# EAGLE design M705ok (EAGLE 6.6.0)
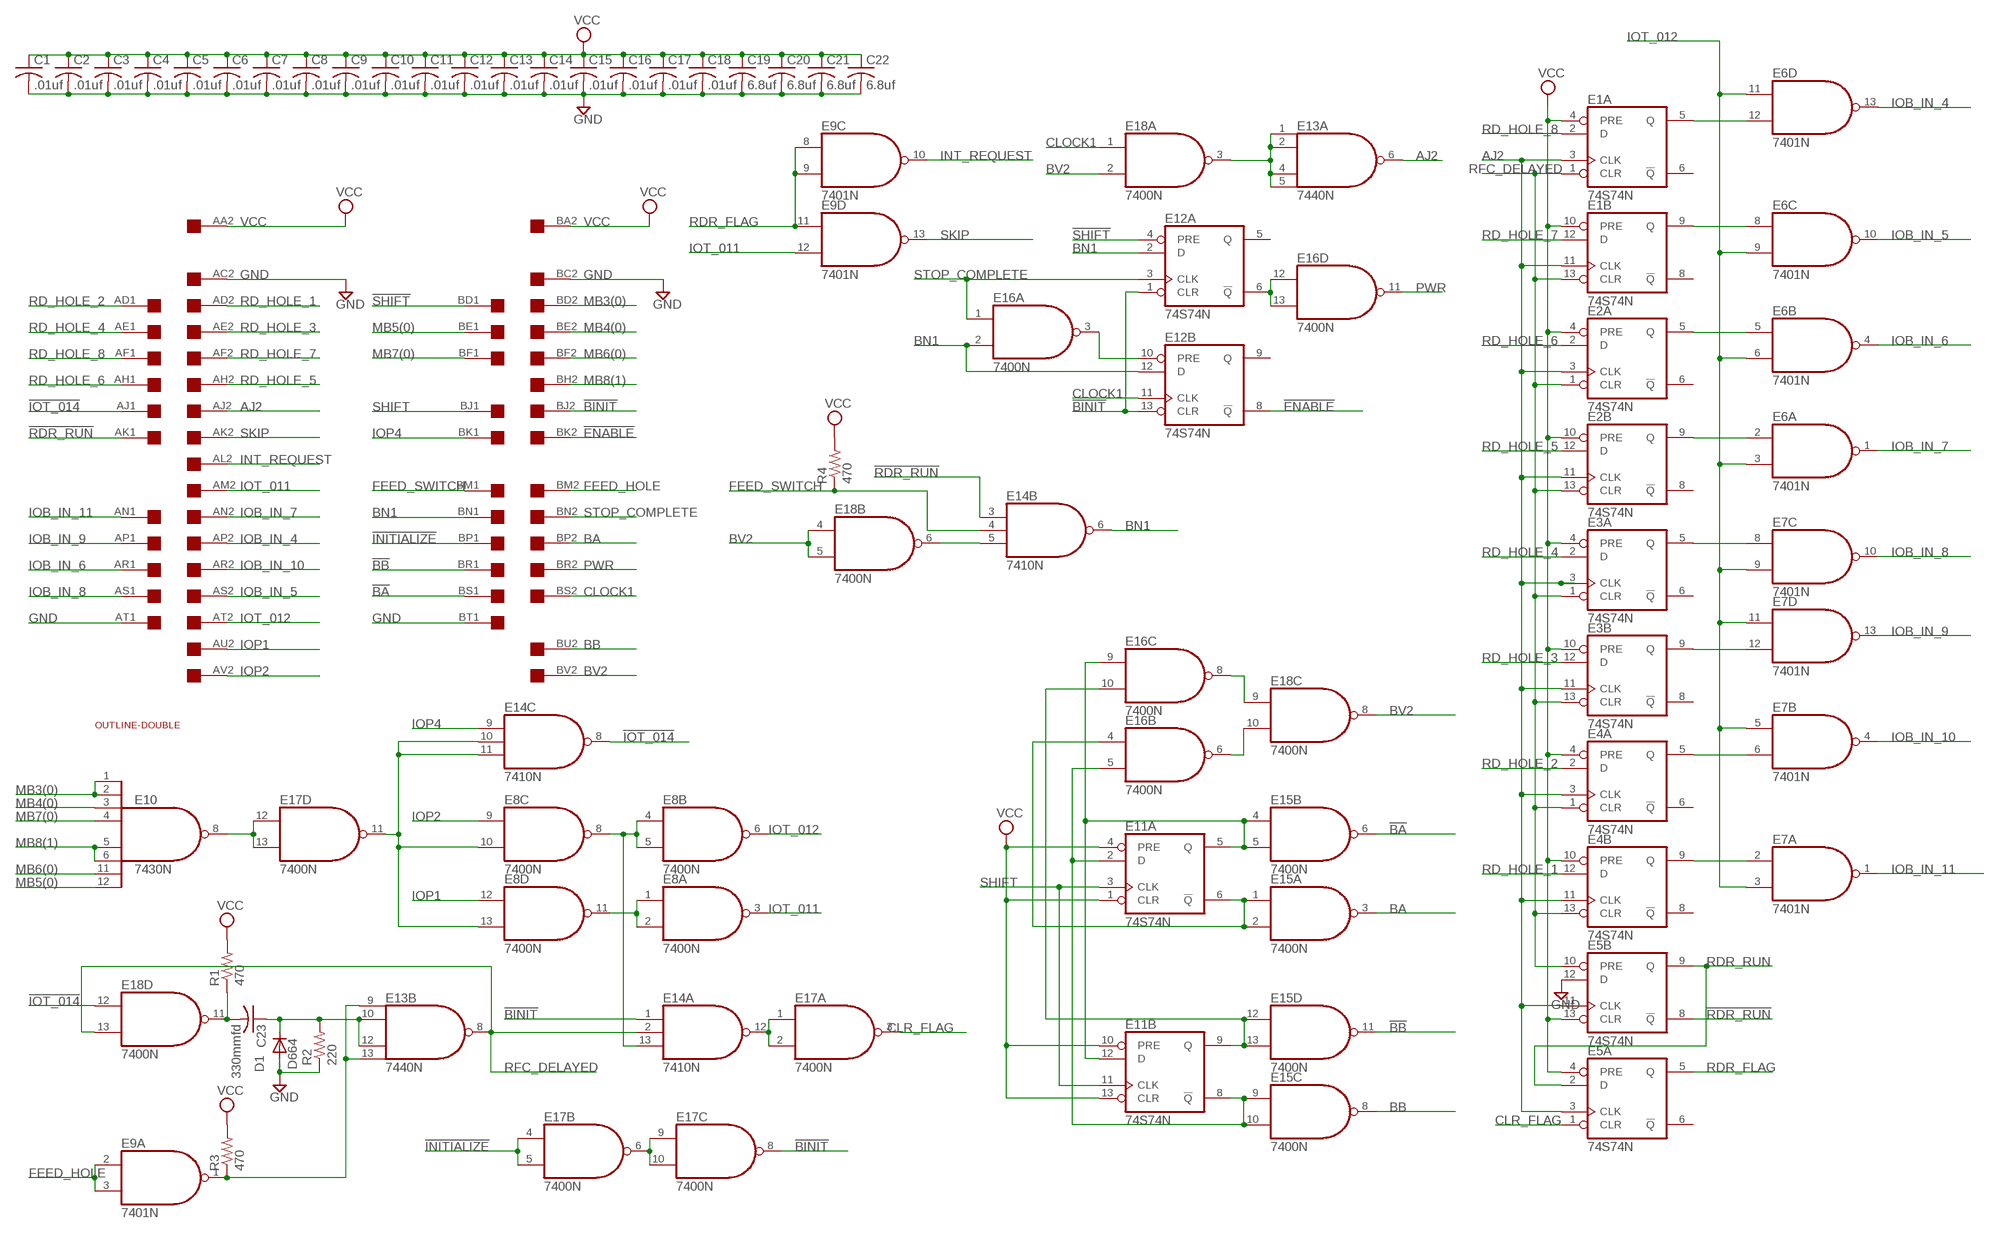
[diagram p0: schematic, sheet 1]

## Parts
C1  .01uf  C-US050-025X075  [C050-025X075]
C2  .01uf  C-US050-025X075  [C050-025X075]
C3  .01uf  C-US050-025X075  [C050-025X075]
C4  .01uf  C-US050-025X075  [C050-025X075]
C5  .01uf  C-US050-025X075  [C050-025X075]
C6  .01uf  C-US050-025X075  [C050-025X075]
C7  .01uf  C-US050-025X075  [C050-025X075]
C8  .01uf  C-US050-025X075  [C050-025X075]
C9  .01uf  C-US050-025X075  [C050-025X075]
C10  .01uf  C-US050-025X075  [C050-025X075]
C11  .01uf  C-US050-025X075  [C050-025X075]
C12  .01uf  C-US050-025X075  [C050-025X075]
C13  .01uf  C-US050-025X075  [C050-025X075]
C14  .01uf  C-US050-025X075  [C050-025X075]
C15  .01uf  C-US050-025X075  [C050-025X075]
C16  .01uf  C-US050-025X075  [C050-025X075]
C17  .01uf  C-US050-025X075  [C050-025X075]
C18  .01uf  C-US050-025X075  [C050-025X075]
C19  6.8uf  C-US150-054X183  [C150-054X183]
C20  6.8uf  C-US150-054X183  [C150-054X183]
C21  6.8uf  C-US150-054X183  [C150-054X183]
C22  6.8uf  C-US150-054X183  [C150-054X183]
C23  330mmfd  C-US050-025X075  [C050-025X075]
D1  D664  1N4148DO35-10  [DO35-10]
E1  74S74N  [DIL14]
E2  74S74N  [DIL14]
E3  74S74N  [DIL14]
E4  74S74N  [DIL14]
E5  74S74N  [DIL14]
E6  7401N  74LS01N  [DIL14]
E7  7401N  74LS01N  [DIL14]
E8  7400N  [DIL14]
E9  7401N  74LS01N  [DIL14]
E10  7430N  [DIL14]
E11  74S74N  [DIL14]
E12  74S74N  [DIL14]
E13  7440N  74S20N  [DIL14]
E14  7410N  [DIL14]
E15  7400N  [DIL14]
E16  7400N  [DIL14]
E17  7400N  [DIL14]
E18  7400N  [DIL14]
R1  470  R-US_0207/10  [0207/10]
R2  220  R-US_0207/10  [0207/10]
R3  470  R-US_0207/10  [0207/10]
R4  470  R-US_0207/10  [0207/10]
U$5  DOUBLE  [EDGE-CON4]
U$6  OUTLINE-DOUBLE  [DOUBLE]

## Nets
!BA: E15.6(B:O) U$5.BS1
!BB: E15.11(D:O) U$5.BR1
!BINIT: E12.1(A:CLR) E12.13(B:CLR) E14.1(A:I0) E17.8(C:O) U$5.BJ2
!ENABLE: E12.8(B:!Q) U$5.BK2
!INITIALIZE: E17.4(B:I0) E17.5(B:I1) U$5.BP1
!IOT_014: E14.8(C:O) E18.12(D:I0) U$5.AJ1
!RDR_RUN: E5.8(B:!Q) E14.3(B:I0) U$5.AK1
!SHIFT: E12.4(A:PRE) U$5.BD1
AJ2: E1.3(A:CLK) E1.11(B:CLK) E2.3(A:CLK) E2.11(B:CLK) E3.3(A:CLK) E3.11(B:CLK) E4.3(A:CLK) E4.11(B:CLK) E5.3(A:CLK) E5.11(B:CLK) E13.6(A:O) U$5.AJ2
BA: E15.3(A:O) U$5.BP2
BB: E15.8(C:O) U$5.BU2
BN1: E12.2(A:D) E12.12(B:D) E14.6(B:O) E16.2(A:I1) U$5.BN1
BV2: E18.2(A:I1) E18.4(B:I0) E18.5(B:I1) E18.8(C:O) U$5.BV2
CLOCK1: E12.11(B:CLK) E18.1(A:I0) U$5.BS2
CLR_FLAG: E5.1(A:CLR) E17.3(A:O)
FEED_HOLE: E9.2(A:I0) E9.3(A:I1) U$5.BM2
FEED_SWITCH: E14.4(B:I1) R4.1 U$5.BM1
GND: C1.2 C2.2 C3.2 C4.2 C5.2 C6.2 C7.2 C8.2 C9.2 C10.2 C11.2 C12.2 C13.2 C14.2 C15.2 C16.2 C17.2 C18.2 C19.2 C20.2 C21.2 C22.2 D1.A E5.12(B:D) R2.1 U$5.AC2 U$5.AT1 U$5.BC2 U$5.BT1
INT_REQUEST: E9.10(C:O) U$5.AL2
IOB_IN_4: E6.13(D:O) U$5.AP2
IOB_IN_5: E6.10(C:O) U$5.AS2
IOB_IN_6: E6.4(B:O) U$5.AR1
IOB_IN_7: E6.1(A:O) U$5.AN2
IOB_IN_8: E7.10(C:O) U$5.AS1
IOB_IN_9: E7.13(D:O) U$5.AP1
IOB_IN_10: E7.4(B:O) U$5.AR2
IOB_IN_11: E7.1(A:O) U$5.AN1
IOP1: E8.12(D:I0) U$5.AU2
IOP2: E8.9(C:I0) U$5.AV2
IOP4: E14.9(C:I0) U$5.BK1
IOT_011: E8.3(A:O) E9.12(D:I1) U$5.AM2
IOT_012: E6.3(A:I1) E6.6(B:I1) E6.9(C:I1) E6.11(D:I0) E7.3(A:I1) E7.5(B:I0) E7.9(C:I1) E7.11(D:I0) E8.6(B:O) U$5.AT2
MB3(0): E10.1(I0) E10.2(I1) U$5.BD2
MB4(0): E10.3(I2) U$5.BE2
MB5(0): E10.12(I7) U$5.BE1
MB6(0): E10.11(I6) U$5.BF2
MB7(0): E10.4(I3) U$5.BF1
MB8(1): E10.5(I4) E10.6(I5) U$5.BH2
N$2: E1.5(A:Q) E6.12(D:I1)
N$3: E1.9(B:Q) E6.8(C:I0)
N$4: E11.6(A:!Q) E15.1(A:I0) E15.2(A:I1) E16.4(B:I0)
N$5: E10.8(O) E17.12(D:I0) E17.13(D:I1)
N$6: E8.4(B:I0) E8.5(B:I1) E8.8(C:O) E14.13(A:I2)
N$7: E8.1(A:I0) E8.2(A:I1) E8.11(D:O)
N$8: E8.10(C:I1) E8.13(D:I1) E14.10(C:I1) E14.11(C:I2) E17.11(D:O)
N$9: E2.5(A:Q) E6.5(B:I0)
N$10: E2.9(B:Q) E6.2(A:I0)
N$11: E3.5(A:Q) E7.8(C:I0)
N$12: E3.9(B:Q) E7.12(D:I1)
N$13: E4.5(A:Q) E7.6(B:I1)
N$14: E4.9(B:Q) E7.2(A:I0)
N$16: E11.5(A:Q) E11.12(B:D) E15.4(B:I0) E15.5(B:I1) E16.9(C:I0)
N$17: E11.9(B:Q) E15.12(D:I0) E15.13(D:I1) E16.10(C:I1)
N$18: E11.2(A:D) E11.8(B:!Q) E15.9(C:I0) E15.10(C:I1) E16.5(B:I1)
N$19: E16.8(C:O) E18.9(C:I0)
N$20: E16.6(B:O) E18.10(C:I1)
N$21: E13.1(A:I0) E13.2(A:I1) E13.4(A:I2) E13.5(A:I3) E18.3(A:O)
N$22: E12.6(A:!Q) E16.12(D:I0) E16.13(D:I1)
N$23: E12.10(B:PRE) E16.3(A:O)
N$24: C23.2 E18.11(D:O) R1.1
N$25: C23.1 D1.C E13.10(B:I1) E13.12(B:I2) R2.2
N$26: E9.1(A:O) E13.9(B:I0) E13.13(B:I3) R3.1
N$28: E17.6(B:O) E17.9(C:I0) E17.10(C:I1)
N$29: E14.12(A:O) E17.1(A:I0) E17.2(A:I1)
N$30: E14.5(B:I2) E18.6(B:O)
PWR: E16.11(D:O) U$5.BR2
RD_HOLE_1: E4.12(B:D) U$5.AD2
RD_HOLE_2: E4.2(A:D) U$5.AD1
RD_HOLE_3: E3.12(B:D) U$5.AE2
RD_HOLE_4: E3.2(A:D) U$5.AE1
RD_HOLE_5: E2.12(B:D) U$5.AH2
RD_HOLE_6: E2.2(A:D) U$5.AH1
RD_HOLE_7: E1.12(B:D) U$5.AF2
RD_HOLE_8: E1.2(A:D) U$5.AF1
RDR_FLAG: E5.5(A:Q) E9.8(C:I0) E9.9(C:I1) E9.11(D:I0)
RDR_RUN: E5.2(A:D) E5.9(B:Q)
RFC_DELAYED: E1.1(A:CLR) E1.13(B:CLR) E2.1(A:CLR) E2.13(B:CLR) E3.1(A:CLR) E3.13(B:CLR) E4.1(A:CLR) E4.13(B:CLR) E5.10(B:PRE) E13.8(B:O) E14.2(A:I1) E18.13(D:I1)
SHIFT: E11.3(A:CLK) E11.11(B:CLK) U$5.BJ1
SKIP: E9.13(D:O) U$5.AK2
STOP_COMPLETE: E12.3(A:CLK) E16.1(A:I0) U$5.BN2
VCC: C1.1 C2.1 C3.1 C4.1 C5.1 C6.1 C7.1 C8.1 C9.1 C10.1 C11.1 C12.1 C13.1 C14.1 C15.1 C16.1 C17.1 C18.1 C19.1 C20.1 C21.1 C22.1 E1.4(A:PRE) E1.10(B:PRE) E2.4(A:PRE) E2.10(B:PRE) E3.4(A:PRE) E3.10(B:PRE) E4.4(A:PRE) E4.10(B:PRE) E5.4(A:PRE) E5.13(B:CLR) E11.1(A:CLR) E11.4(A:PRE) E11.10(B:PRE) E11.13(B:CLR) R1.2 R3.2 R4.2 U$5.AA2 U$5.BA2
Unconnected: E1.6(A:!Q) E1.8(B:!Q) E2.6(A:!Q) E2.8(B:!Q) E3.6(A:!Q) E3.8(B:!Q) E4.6(A:!Q) E4.8(B:!Q) E5.6(A:!Q) E9.4(B:O) E9.5(B:I0) E9.6(B:I1) E12.5(A:Q) E12.9(B:Q) U$5.AA1 U$5.AB1 U$5.AB2 U$5.AC1 U$5.AL1 U$5.AM1 U$5.AU1 U$5.AV1 U$5.BA1 U$5.BB1 U$5.BB2 U$5.BC1 U$5.BH1 U$5.BL1 U$5.BL2 U$5.BT2 U$5.BU1 U$5.BV1

## Power pins joined to a net without a drawn wire
GND: E1.7(P:GND) E2.7(P:GND) E3.7(P:GND) E4.7(P:GND) E5.7(P:GND) E6.7(P:GND) E7.7(P:GND) E8.7(P:GND) E9.7(P:GND) E10.7(GND) E11.7(P:GND) E12.7(P:GND) E13.7(P:GND) E14.7(P:GND) E15.7(P:GND) E16.7(P:GND) E17.7(P:GND) E18.7(P:GND)
VCC: E1.14(P:VCC) E2.14(P:VCC) E3.14(P:VCC) E4.14(P:VCC) E5.14(P:VCC) E6.14(P:VCC) E7.14(P:VCC) E8.14(P:VCC) E9.14(P:VCC) E10.14(VCC) E11.14(P:VCC) E12.14(P:VCC) E13.14(P:VCC) E14.14(P:VCC) E15.14(P:VCC) E16.14(P:VCC) E17.14(P:VCC) E18.14(P:VCC)

## Library data of the parts
C1-C23 = rcl:C-US: CAPACITOR, American symbol
D1 = diode:1N4148: DIODE high speed (Philips)
E1-E5 E11 E12 = 74xx-us:74*74: Dual D type positive edge triggered FLIP FLOP, preset and clear
E6 E7 E9 = 74xx-us:74*01: Quad 2-input NAND gate, open collector
E8 E15-E18 = 74xx-us:74*00: Quad 2-input NAND gate
E10 = 74xx-us:74*30: 8-input NAND gate
E13 = 74xx-us:74*20: Dual 4-input NAND gate
E14 = 74xx-us:74*10: Triple 3-input NAND gate
R1-R4 = rcl:R-US_: RESISTOR, American symbol
U$5 = dec-con:DOUBLE: Double-Height DEC board
U$6 = dec-con:OUTLINE-*: Board outlines for DEC boards.

## Board
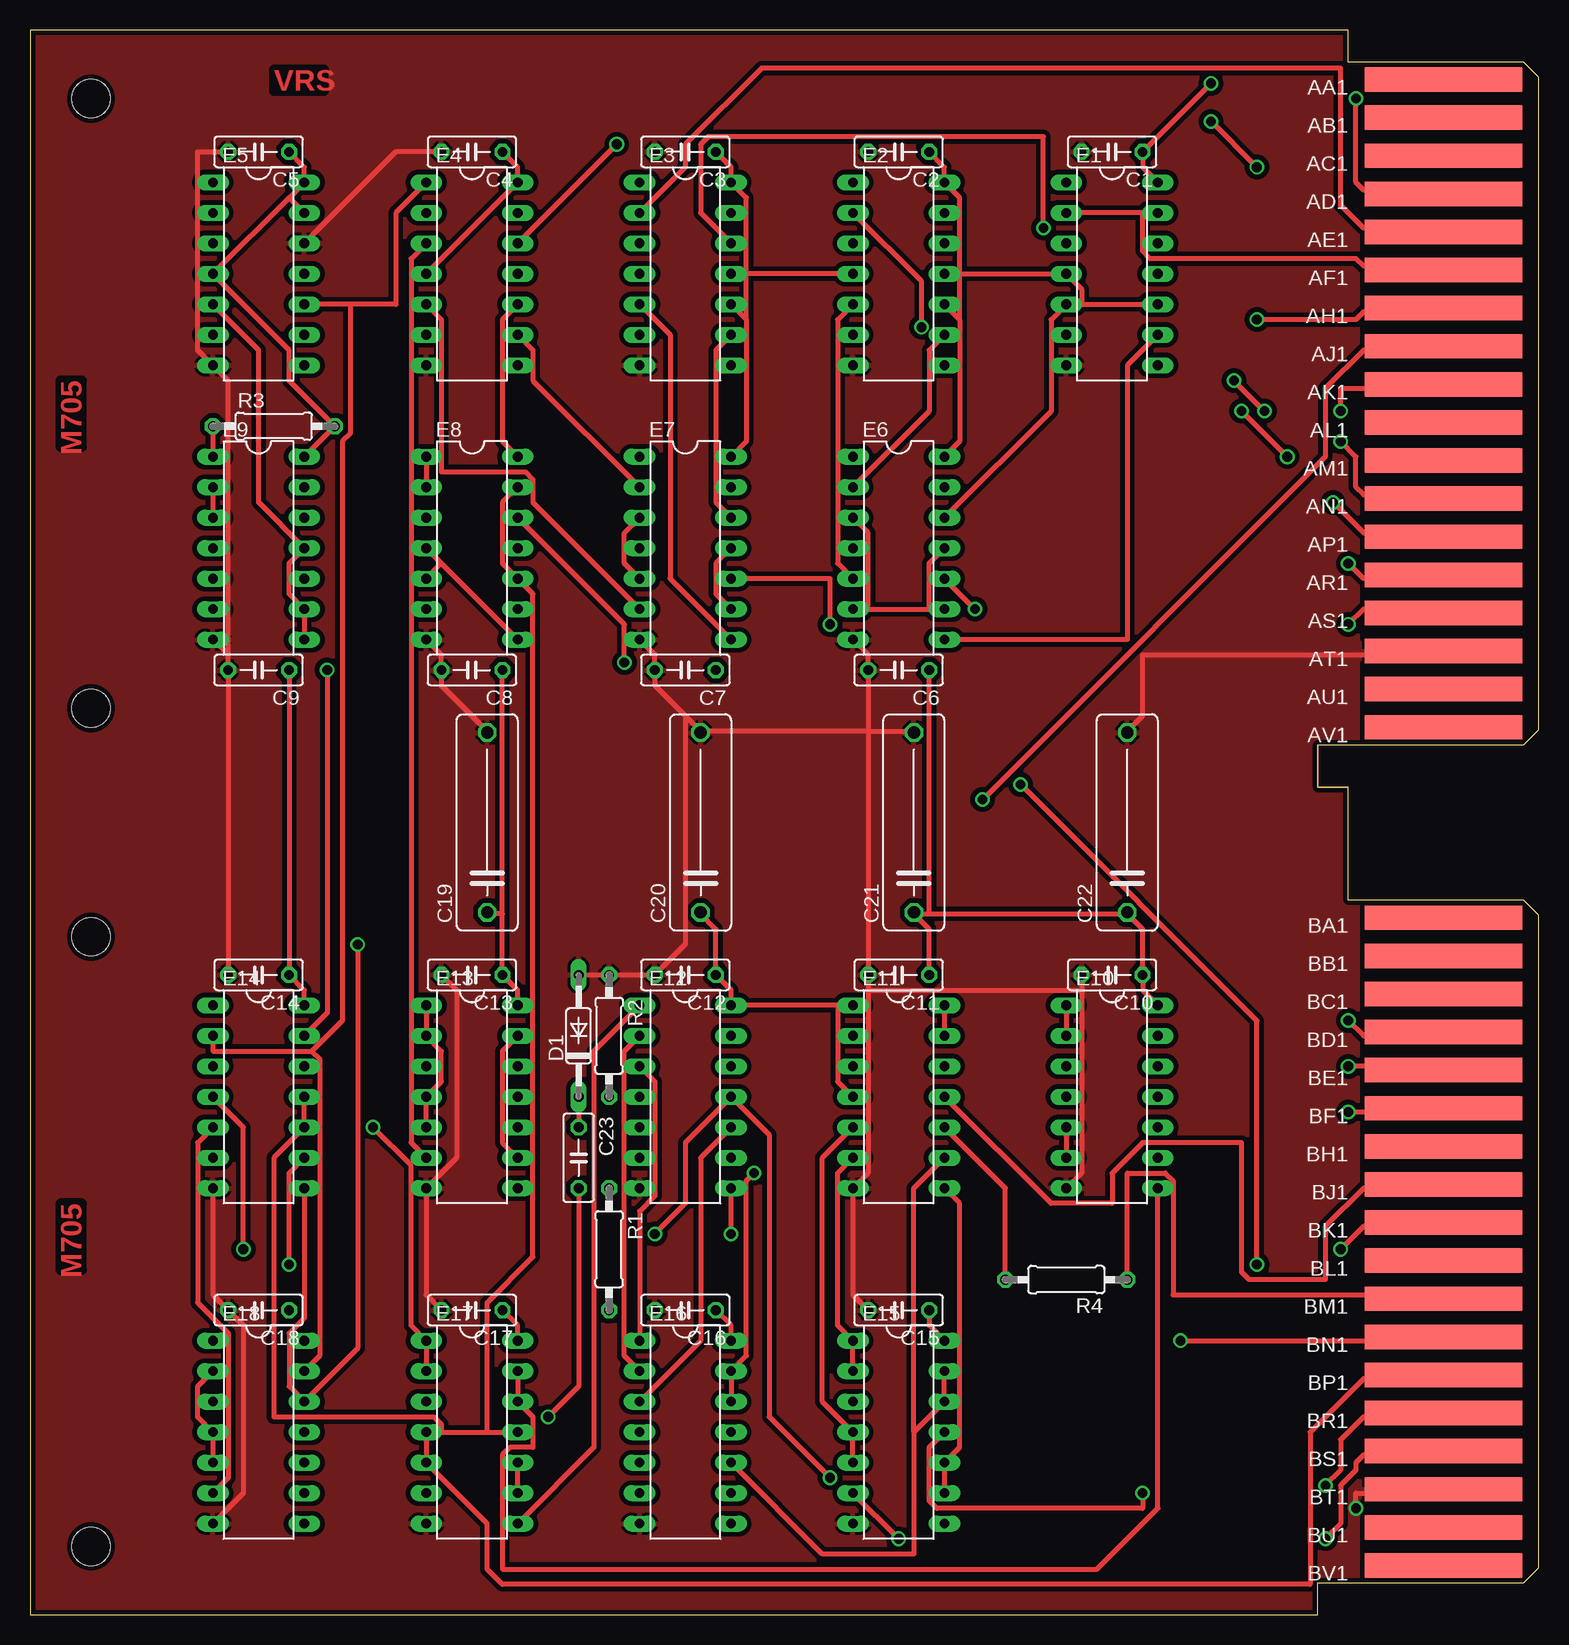
[diagram p1: board, top side]
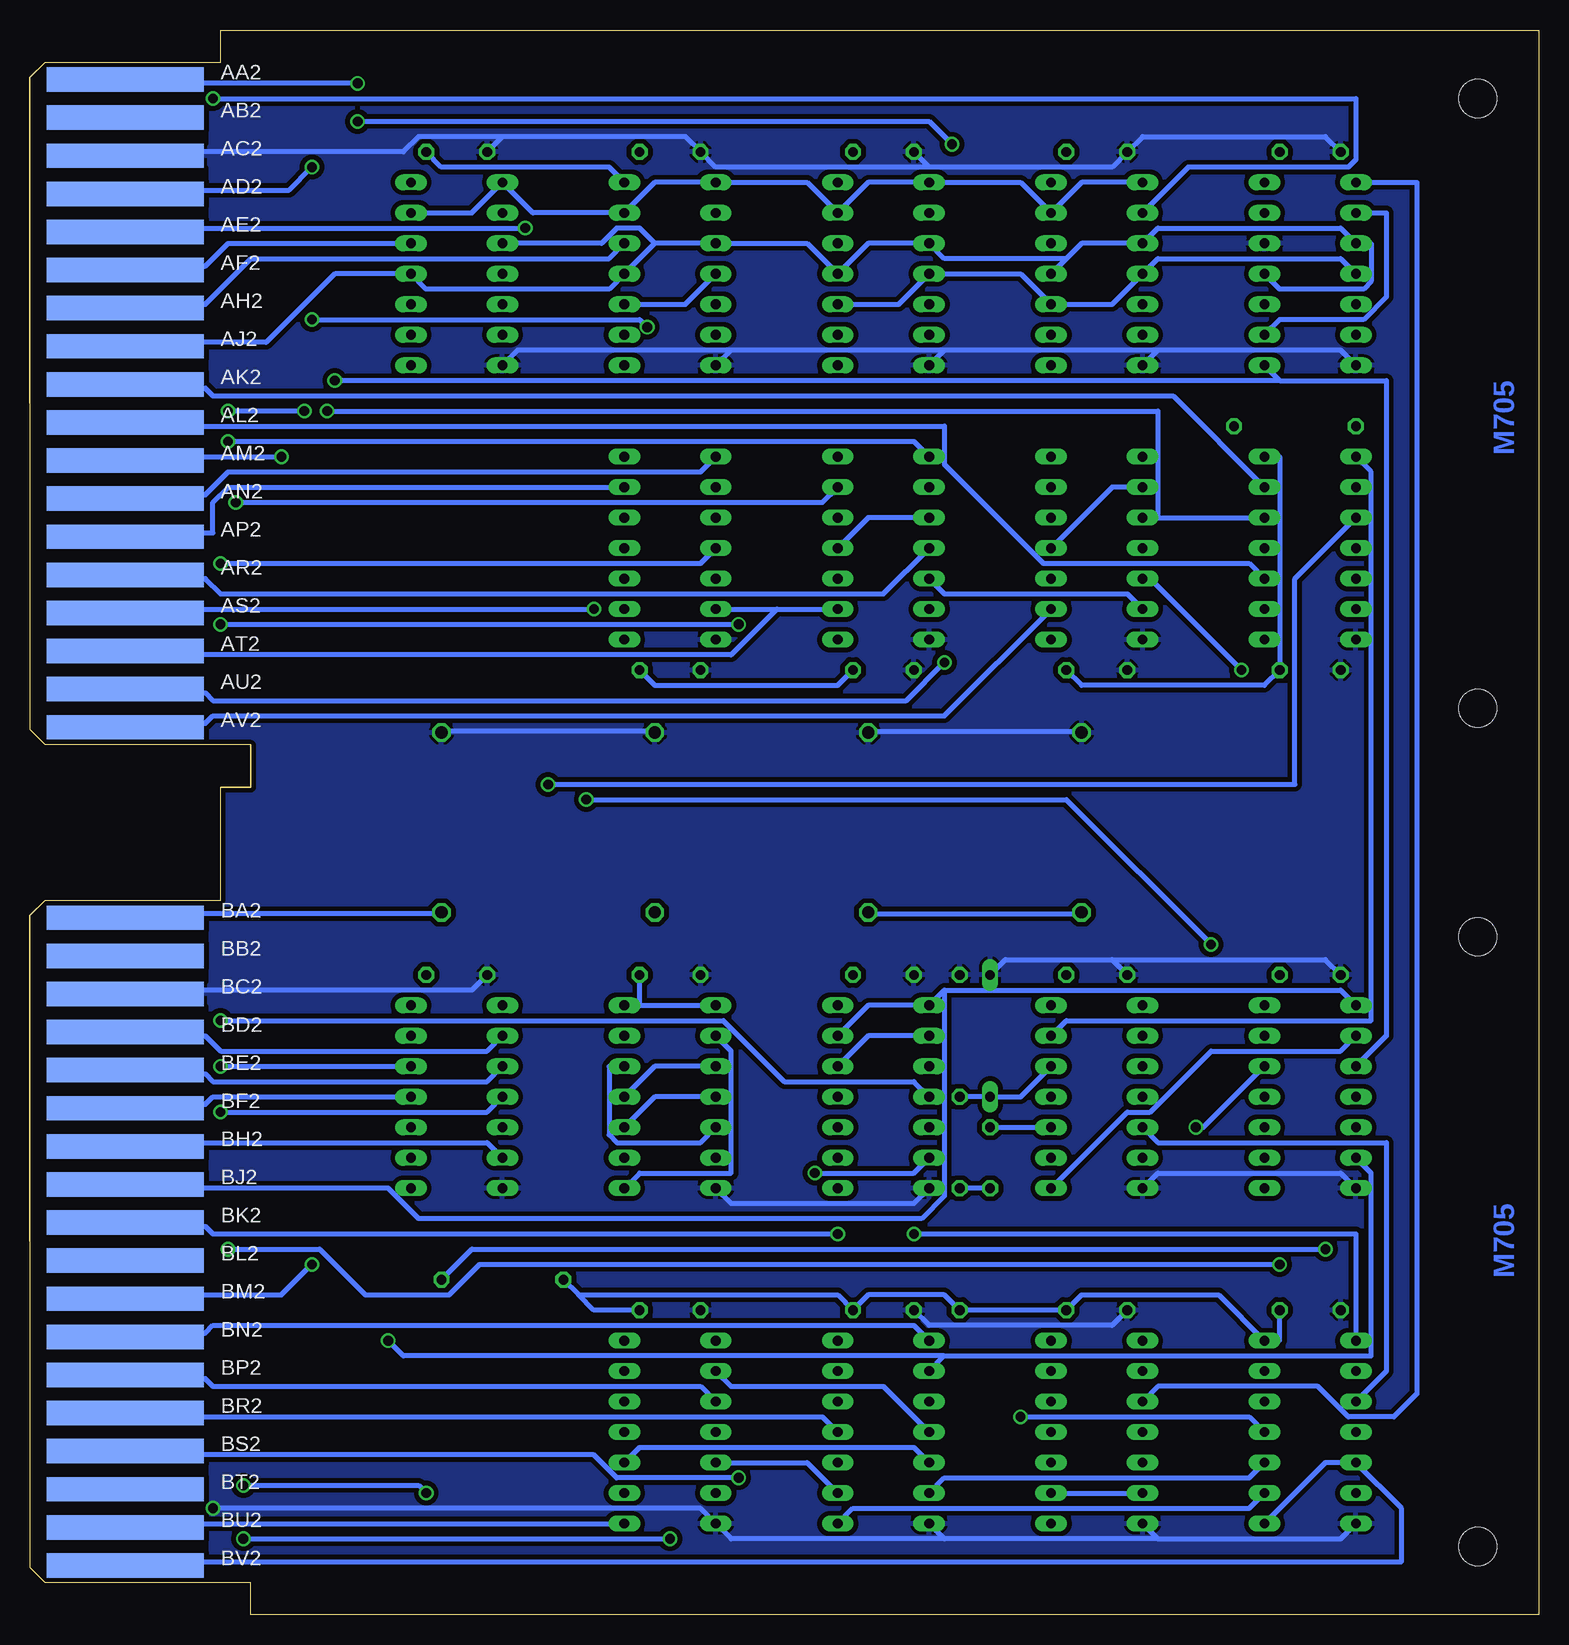
[diagram p2: board, bottom side, seen from below]

Size 125.73 x 132.08 mm. Coordinates in mm from the lower left corner, seen from the top.
Copper layers (1+16): Top 0.035mm / dielectric 1.5mm / Bottom 0.035mm
Design rules "16mils": minimum track width 16mil, minimum drill 32mil, track to track 15mil, track to pad 10mil, pad to pad 10mil, via to via 10mil, smd to smd 10mil, copper to edge 13mil, drill to drill 10mil, minimum pad ring 10mil, minimum via ring 8mil, stop-mask expansion 0mil, vias tented up to drill 0mil, thermal gap 10mil
vRestrict: area 31.8,108 to 41.9,125.7; area 49.5,108 to 59.7,125.7; area 67.3,108 to 77.5,125.7; area 85.1,108 to 95.2,125.7; area 102.9,108 to 113,125.7; area 31.8,80 to 41.9,97.8; area 49.5,80 to 59.7,97.8; area 67.3,80 to 77.5,97.8; area 85.1,80 to 95.2,97.8; area 31.8,34.3 to 41.9,52.1; area 49.5,34.3 to 59.7,52.1; area 67.3,34.3 to 77.5,52.1; area 85.1,34.3 to 95.2,52.1; area 102.9,11.4 to 113,29.2; area 85.1,11.4 to 95.2,29.2; area 49.5,11.4 to 59.7,29.2; area 31.8,11.4 to 41.9,29.2; area 67.3,11.4 to 77.5,29.2

### Footprints (pad centres in the part's own frame; a part is rotated, then mirrored left to right if it is on the bottom)
C050-025X075 = drill 0.813 octagon: 1 -2.54,0; 2 2.54,0
C150-054X183 = drill 1.016 octagon: 1 -7.493,0; 2 7.493,0
DO35-10 = drill 0.813 long: A 5.08,0; C -5.08,0
DIL14 = drill 0.813 long: 1 -7.62,-3.81; 2 -5.08,-3.81; 3 -2.54,-3.81; 4 0,-3.81; 5 2.54,-3.81; 6 5.08,-3.81; 7 7.62,-3.81; 8 7.62,3.81; 9 5.08,3.81; 10 2.54,3.81; 11 0,3.81; 12 -2.54,3.81; 13 -5.08,3.81; 14 -7.62,3.81
0207/10 = drill 0.813 octagon: 1 -5.08,0; 2 5.08,0
EDGE-CON4 = smd 13.106 x 2.032: AA1 7.938,4.128; AB1 7.938,7.303; AC1 7.938,10.477; AD1 7.938,13.652; AE1 7.938,16.828; AF1 7.938,20.003; AH1 7.938,23.177; AJ1 7.938,26.352; AK1 7.938,29.527; AL1 7.938,32.703; AM1 7.938,35.877; AN1 7.938,39.053; AP1 7.938,42.227; AR1 7.938,45.403; AS1 7.938,48.578; AT1 7.938,51.752; AU1 7.938,54.928; AV1 7.938,58.102; BA1 7.938,73.978; BB1 7.938,77.153; BC1 7.938,80.328; BD1 7.938,83.502; BE1 7.938,86.677; BF1 7.938,89.853; BH1 7.938,93.028; BJ1 7.938,96.203; BK1 7.938,99.377; BL1 7.938,102.552; BM1 7.938,105.728; BN1 7.938,108.903; BP1 7.938,112.078; BR1 7.938,115.252; BS1 7.938,118.427; BT1 7.938,121.603; BU1 7.938,124.778; BV1 7.938,127.953 | smd 13.106 x 2.032 bottom: AA2 7.938,4.128; AB2 7.938,7.303; AC2 7.938,10.477; AD2 7.938,13.652; AE2 7.938,16.828; AF2 7.938,20.003; AH2 7.938,23.177; AJ2 7.938,26.352; AK2 7.938,29.527; AL2 7.938,32.703; AM2 7.938,35.877; AN2 7.938,39.053; AP2 7.938,42.227; AR2 7.938,45.403; AS2 7.938,48.578; AT2 7.938,51.752; AU2 7.938,54.928; AV2 7.938,58.102; BA2 7.938,73.978; BB2 7.938,77.153; BC2 7.938,80.328; BD2 7.938,83.502; BE2 7.938,86.677; BF2 7.938,89.853; BH2 7.938,93.028; BJ2 7.938,96.203; BK2 7.938,99.377; BL2 7.938,102.552; BM2 7.938,105.728; BN2 7.938,108.903; BP2 7.938,112.078; BR2 7.938,115.252; BS2 7.938,118.427; BT2 7.938,121.603; BU2 7.938,124.778; BV2 7.938,127.953
DOUBLE = hole 3.175: 120.65,56.515; 120.65,5.715; 120.65,75.565; 120.65,126.365

### Placement (x,y rotation side)
C1  90.17,121.92 180 top
C2  72.39,121.92 180 top
C3  54.61,121.92 180 top
C4  36.83,121.92 180 top
C5  19.05,121.92 180 top
C6  72.39,78.74 180 top
C7  54.61,78.74 180 top
C8  36.83,78.74 180 top
C9  19.05,78.74 180 top
C10  90.17,53.34 180 top
C11  72.39,53.34 180 top
C12  54.61,53.34 180 top
C13  36.83,53.34 180 top
C14  19.05,53.34 180 top
C15  72.39,25.4 180 top
C16  54.61,25.4 180 top
C17  36.83,25.4 180 top
C18  19.05,25.4 180 top
C19  38.1,66.04 90 top
C20  55.88,66.04 90 top
C21  73.66,66.04 90 top
C22  91.44,66.04 90 top
C23  45.72,38.1 270 top
D1  1N4148DO35-10  [DO35-10]  45.72,48.26 90 top
E1  90.17,111.76 270 top
E2  72.39,111.76 270 top
E3  54.61,111.76 270 top
E4  36.83,111.76 270 top
E5  19.05,111.76 270 top
E6  72.39,88.9 270 top
E7  54.61,88.9 270 top
E8  36.83,88.9 270 top
E9  19.05,88.9 270 top
E10  90.17,43.18 270 top
E11  72.39,43.18 270 top
E12  54.61,43.18 270 top
E13  36.83,43.18 270 top
E14  19.05,43.18 270 top
E15  72.39,15.24 270 top
E16  54.61,15.24 270 top
E17  36.83,15.24 270 top
E18  19.05,15.24 270 top
R1  48.26,30.48 270 top
R2  48.26,48.26 270 top
R3  20.32,99.06 0 top
R4  86.36,27.94 180 top
U$5  125.73,132.08 180 top
U$6  125.73,132.08 180 top

### Tracks (layer width: path | path; a pad name or v marks a point on that pad's centre or on a via)
!BA  (via drill 0.81)
  Top 0.406: v72.39,6.35 E15.6 | v107.95,6.35 109.22,7.62 109.22,10.79 110.49,12.06 110.49,12.7 111.12,13.34 117.47,13.34 U$5.BS1
  Bottom 0.406: v107.95,6.35 v72.39,6.35
!BB  (via drill 0.81)
  Top 0.406: E15.11 74.93,13.97 74.93,9.53 75.56,8.89 92.71,8.89 v92.71,10.16 | v107.95,10.79 109.22,12.06 109.22,14.61 111.12,16.51 117.47,16.51 U$5.BR1
  Bottom 0.406: v92.71,10.16 93.34,10.79 v107.95,10.79
!BINIT
  Top 0.406: E17.8 46.99,13.97 46.99,46.99 E12.1
  Bottom 0.406: E12.13 55.88,50.8 E12.1 49.53,52.07 | E14.1 16.51,52.07 49.53,52.07 | 49.53,52.07 49.53,34.92 51.44,33.02 93.34,33.02 95.89,35.56 117.47,35.56 U$5.BJ2
!ENABLE  (via drill 0.81)
  Top 0.406: v58.42,31.75 E12.8
  Bottom 0.406: v58.42,31.75 110.49,31.75 111.12,32.38 117.47,32.38 U$5.BK2
!INITIALIZE
  Top 0.406: E17.4 E17.5 38.1,7.62 38.1,3.81 39.37,2.54 106.68,2.54 106.68,15.24 111.12,19.68 117.47,19.68 U$5.BP1
!IOT_014  (via drill 0.81)
  Top 0.406: E14.8 22.86,24.77 21.59,23.5 21.59,19.05 E18.12 27.3,22.23 v27.3,55.88 | v79.38,67.94 107.95,96.52 107.95,102.23 111.12,105.41 117.47,105.41 U$5.AJ1
  Bottom 0.406: v27.3,55.88 39.37,67.94 v79.38,67.94
!RDR_RUN  (via drill 0.81)
  Top 0.406: v109.22,100.33 109.22,102.23 117.47,102.23 U$5.AK1 | v100.33,102.87 v102.87,100.33
  Bottom 0.406: E14.3 12.7,48.26 12.7,102.87 21.59,102.87 | E5.8 21.59,102.87 | v102.87,100.33 v109.22,100.33 | 21.59,102.87 v100.33,102.87
!SHIFT  (via drill 0.81)
  Top 0.406: v109.86,49.53 111.12,48.26 117.47,48.26 U$5.BD1
  Bottom 0.406: E12.4 52.07,44.45 62.87,44.45 67.94,49.53 v109.86,49.53
AJ2
  Top 0.406: E13.6 31.75,39.37 31.75,113.03 E4.3
  Bottom 0.406: 73.66,114.3 E2.11 77.47,110.49 92.71,110.49 E1.11 100.33,111.76 106.05,106.05 117.47,106.05 U$5.AJ2 | 73.66,114.3 E2.3 60.96,114.3 E3.11 55.88,114.3 E3.3 49.53,113.03 39.37,113.03 | E1.3 78.11,114.3 76.83,115.57 74.93,115.57 73.66,114.3 | E5.11 21.59,110.49 14.61,110.49 13.97,111.12 13.97,114.3 E5.3 16.51,115.57 31.75,115.57 E4.3 38.1,114.3 39.37,113.03 | 39.37,113.03 E4.11
BA
  Bottom 0.406: E15.3 69.85,19.05 110.49,19.05 111.12,19.68 117.47,19.68 U$5.BP2
BB
  Bottom 0.406: E15.8 117.47,7.62 U$5.BU2
BN1  (via drill 0.81)
  Top 0.406: E12.2 49.53,46.99 49.53,21.59 E16.2 | v95.89,22.86 117.47,22.86 U$5.BN1
  Bottom 0.406: E12.12 55.88,48.26 E12.2 | E14.6 13.97,36.83 13.97,21.59 49.53,21.59 | E16.2 49.53,21.59 | v95.89,22.86 94.61,21.59 49.53,21.59
BV2
  Top 0.406: E18.5 E18.4 13.97,16.51 13.97,19.05 E18.2
  Bottom 0.406: E18.8 17.78,12.7 E18.5 11.43,8.89 11.43,4.45 117.47,4.45 U$5.BV2
CLOCK1  (via drill 0.81)
  Top 0.406: v52.07,31.75 54.61,34.29 54.61,39.37 E12.11 61.59,40.01 61.59,16.51 v66.67,11.43
  Bottom 0.406: E18.1 15.24,31.75 v52.07,31.75 | v66.67,11.43 76.83,11.43 78.74,13.34 117.47,13.34 U$5.BS2
CLR_FLAG
  Bottom 0.406: E17.3 31.75,19.05 18.41,19.05 15.88,16.51 12.06,16.51 10.16,18.41 10.16,119.38 E5.1
FEED_HOLE  (via drill 0.81)
  Top 0.406: E9.2 E9.3 | v82.55,69.22 102.23,49.53 v102.23,29.21
  Bottom 0.406: E9.3 20.32,86.36 20.32,69.22 v82.55,69.22 | v102.23,29.21 104.78,26.67 117.47,26.67 U$5.BM2
FEED_SWITCH  (via drill 0.81)
  Top 0.406: E14.4 17.78,40.64 v17.78,30.48 | R4.1 91.44,36.83 94.61,36.83 95.25,36.2 95.25,26.67 117.47,26.67 U$5.BM1
  Bottom 0.406: v17.78,30.48 88.9,30.48 R4.1
GND  (via drill 0.81)
  Top 0.406: v110.49,8.89 110.49,10.16 117.47,10.16 U$5.BT1 | E5.12 30.48,121.92 C4.2 | C14.2 C9.2 16.51,80.01 | 16.51,80.01 E9.7 | 16.51,80.01 16.51,102.87 E5.7 13.97,105.41 13.97,121.92 C5.2 | E14.7 15.24,26.67 C18.2 17.78,24.13 17.78,10.16 E18.7 | C17.2 33.02,26.67 E13.7 35.56,38.1 35.56,52.07 C13.2 | D1.A R2.1 C12.2 54.61,55.88 54.61,74.93 | E8.7 34.29,80.01 C8.2 34.29,77.47 38.1,73.66 C19.2 | E7.7 52.07,80.01 C7.2 52.07,77.47 54.61,74.93 | 54.61,74.93 55.88,73.66 | C15.2 68.58,26.67 E11.7 69.85,36.83 69.85,52.07 | E10.7 87.63,36.83 87.63,52.07 | C10.2 87.63,52.07 | 69.85,73.66 C6.2 69.85,80.01 E6.7 | 69.85,73.66 C11.2 69.85,52.07 | 69.85,73.66 73.66,73.66 C21.2 | 69.85,52.07 87.63,52.07 | U$5.AT1 117.47,80.01 92.71,80.01 92.71,74.93 91.44,73.66 C22.2 | 69.85,73.66 55.88,73.66 | 55.88,73.66 C20.2
  Bottom 0.406: E18.7 16.51,6.35 31.75,6.35 | E17.7 31.75,6.35 | 49.53,6.35 E16.7 | 31.75,6.35 49.53,6.35 | 49.53,6.35 67.31,6.35 E15.7 69.85,8.89 v110.49,8.89 | C5.2 17.78,123.19 33.02,123.19 C4.2 35.56,120.65 50.8,120.65 | 50.8,120.65 C3.2 | 50.8,120.65 68.58,120.65 C2.2 71.12,123.19 86.36,123.19 | 86.36,123.19 C1.2 | 86.36,123.19 93.34,123.19 94.61,121.92 117.47,121.92 U$5.AC2 | 31.75,105.41 E4.7 | 31.75,105.41 16.51,105.41 E5.7 | 49.53,105.41 E3.7 | 31.75,105.41 49.53,105.41 | 67.31,105.41 E2.7 | 49.53,105.41 67.31,105.41 | E1.7 85.09,105.41 67.31,105.41 | C16.2 50.8,24.13 35.56,24.13 C17.2 | E14.7 16.51,36.83 31.75,36.83 E13.7 | 35.56,54.61 C13.2 | 35.56,54.61 44.45,54.61 D1.A | C19.2 38.1,73.66 55.88,73.66 C20.2 | E12.7 52.07,34.29 67.31,34.29 E11.7 | C22.2 91.44,73.66 73.66,73.66 C21.2 | C10.2 88.9,52.07 117.47,52.07 U$5.BC2 | C14.2 17.78,54.61 35.56,54.61
  pour Bottom (isolate 0.406): 0,132.08 111.76,132.08 111.76,0 0,0
  pour Top (isolate 0.406): 0,132.08 111.76,132.08 111.76,0 0,0
INT_REQUEST
  Bottom 0.406: E9.10 24.13,87.63 41.27,87.63 49.53,95.89 49.53,99.06 117.47,99.06 U$5.AL2
IOB_IN_4
  Bottom 0.406: E6.13 109.22,93.98 110.49,92.71 110.49,90.17 117.47,90.17 U$5.AP2
IOB_IN_5  (via drill 0.81)
  Top 0.406: v78.74,83.82 E6.10
  Bottom 0.406: v78.74,83.82 117.47,83.82 U$5.AS2
IOB_IN_6  (via drill 0.81)
  Top 0.406: v109.86,87.63 111.12,86.36 117.47,86.36 U$5.AR1
  Bottom 0.406: E6.4 69.85,87.63 v109.86,87.63
IOB_IN_7
  Bottom 0.406: E6.1 69.85,95.25 109.22,95.25 111.12,93.34 117.47,93.34 U$5.AN2
IOB_IN_8  (via drill 0.81)
  Top 0.406: E7.10 66.67,86.36 v66.67,82.55 | v109.86,82.55 111.12,83.82 117.47,83.82 U$5.AS1
  Bottom 0.406: v109.86,82.55 v66.67,82.55
IOB_IN_9  (via drill 0.81)
  Top 0.406: v108.58,92.71 111.12,90.17 117.47,90.17 U$5.AP1
  Bottom 0.406: E7.13 59.69,92.71 v108.58,92.71
IOB_IN_10
  Bottom 0.406: E7.4 54.61,85.09 109.86,85.09 111.12,86.36 117.47,86.36 U$5.AR2
IOB_IN_11  (via drill 0.81)
  Top 0.406: v109.22,97.79 110.49,96.52 110.49,93.98 111.12,93.34 117.47,93.34 U$5.AN1
  Bottom 0.406: E7.1 52.07,97.79 v109.22,97.79
IOP1  (via drill 0.81)
  Top 0.406: E8.12 49.53,82.55 v49.53,79.38
  Bottom 0.406: v49.53,79.38 52.7,76.2 110.49,76.2 111.12,76.83 117.47,76.83 U$5.AU2
IOP2
  Bottom 0.406: E8.9 49.53,74.93 110.49,74.93 111.12,74.3 117.47,74.3 U$5.AV2
IOP4  (via drill 0.81)
  Top 0.406: E14.9 21.59,36.83 v21.59,29.21 | v109.22,30.48 111.12,32.38 117.47,32.38 U$5.BK1
  Bottom 0.406: v21.59,29.21 88.27,29.21 90.81,26.67 97.79,26.67 101.6,30.48 v109.22,30.48
IOT_011  (via drill 0.81)
  Top 0.406: v104.78,96.52 v100.97,100.33
  Bottom 0.406: E8.3 31.75,91.44 | 31.75,91.44 E9.12 | 31.75,91.44 31.75,100.33 v100.97,100.33 | v104.78,96.52 117.47,96.52 U$5.AM2
IOT_012
  Top 0.406: E6.6 69.85,83.82 | 69.85,83.82 74.93,83.82 | 74.93,83.82 E6.9 | E6.11 74.93,87.63 74.93,83.82 | E6.3 69.85,90.17 69.85,83.82 | E7.3 49.53,90.17 49.53,87.63 E7.5 | E7.9 57.15,85.09 57.15,87.63 E7.11
  Bottom 0.406: E6.6 63.5,83.82 | 63.5,83.82 E7.9 | E8.6 34.29,85.09 49.53,85.09 E7.5 | E7.11 55.88,91.44 E7.3 | 63.5,83.82 67.31,80.01 117.47,80.01 U$5.AT2
MB3(0)
  Top 0.406: E10.1 E10.2
  Bottom 0.406: E10.2 87.63,46.99 109.86,46.99 111.12,48.26 117.47,48.26 U$5.BD2
MB4(0)
  Bottom 0.406: E10.3 87.63,44.45 110.49,44.45 111.12,45.09 117.47,45.09 U$5.BE2
MB5(0)  (via drill 0.81)
  Top 0.406: v109.86,45.72 117.47,45.72 U$5.BE1
  Bottom 0.406: v109.86,45.72 E10.12
MB6(0)
  Bottom 0.406: E10.11 110.49,43.18 111.12,42.55 117.47,42.55 U$5.BF2
MB7(0)  (via drill 0.81)
  Top 0.406: v109.86,41.91 117.47,41.91 U$5.BF1
  Bottom 0.406: E10.4 87.63,41.91 v109.86,41.91
MB8(1)
  Top 0.406: E10.5 E10.6
  Bottom 0.406: E10.6 87.63,39.37 117.47,39.37 U$5.BH2
N$2
  Top 0.406: E6.12 85.09,100.33 85.09,107.95 E1.5
N$3
  Top 0.406: E6.8 91.44,81.28 91.44,104.14 E1.9
N$4
  Top 0.406: E15.2 E15.1 67.31,24.13 67.31,36.83 E11.6
  Bottom 0.406: E16.4 54.61,19.05 67.31,19.05 E15.2
N$5
  Top 0.406: E17.13 E17.12 41.91,16.51 41.91,13.97 40.01,13.97 39.37,13.34 39.37,3.81 88.9,3.81 93.98,8.89 E10.8
N$6  (via drill 0.81)
  Top 0.406: E8.4 34.29,87.63 | 34.29,87.63 E8.8 | E14.13 24.77,50.16 v24.77,78.74 | E8.5 34.29,87.63
  Bottom 0.406: v24.77,78.74 32.38,86.36 E8.5
N$7
  Top 0.406: E8.1 E8.2
  Bottom 0.406: E8.11 35.56,93.98 E8.2
N$8
  Top 0.406: E8.13 39.37,92.71 39.37,87.63 E8.10 41.91,85.09 41.91,29.84 38.1,26.04 38.1,15.24 | 38.1,15.24 34.29,15.24 34.29,15.88 33.66,16.51 20.32,16.51 20.32,38.1 E14.10 E14.11 | 38.1,15.24 E17.11
N$9
  Top 0.406: E6.5 67.31,87.63 67.31,107.95 E2.5
N$10
  Top 0.406: E6.2 74.93,100.33 74.93,105.41 E2.9
N$11
  Top 0.406: E7.8 53.34,86.36 53.34,106.68 E3.5
N$12
  Top 0.406: E7.12 57.15,92.71 57.15,105.41 E3.9
N$13
  Top 0.406: E7.6 41.91,92.71 41.91,94.61 41.27,95.25 34.29,95.25 34.29,107.95 E4.5
N$14
  Top 0.406: E7.2 41.91,102.87 41.91,105.41 E4.9
N$16
  Top 0.406: E15.5 E15.4 66.04,17.78 66.04,38.1 E11.5
  Bottom 0.406: E11.5 69.85,39.37 76.83,39.37 77.47,40.01 77.47,45.72 E11.12 | E16.9 60.96,12.7 E15.5
N$17
  Top 0.406: E16.10 66.04,5.08 73.66,5.08 73.66,15.24 | 73.66,15.24 E15.12 E15.13 | E11.9 73.66,35.56 73.66,15.24
N$18
  Top 0.406: E15.9 E15.10 77.47,13.97 77.47,34.29 E11.8
  Bottom 0.406: E16.5 52.07,13.97 74.93,13.97 E15.10 | E11.2 67.31,46.99 67.31,36.83 74.93,36.83 E11.8
N$19
  Bottom 0.406: E18.9 24.13,8.89 57.15,8.89 E16.8
N$20
  Bottom 0.406: E18.10 24.13,11.43 49.53,11.43 E16.6
N$21
  Top 0.406: E13.1 E13.2 34.29,46.99 34.29,44.45 E13.4 E13.5
  Bottom 0.406: E18.3 12.7,20.32 12.7,39.37 31.75,39.37 E13.5
N$22  (via drill 0.81)
  Top 0.406: E16.12 E16.13 59.69,21.59 59.69,36.2 v60.33,36.83
  Bottom 0.406: E12.6 52.07,36.83 v60.33,36.83
N$23
  Top 0.406: E16.3 55.88,22.86 55.88,38.1 E12.10
N$24  (via drill 0.81)
  Top 0.406: v43.18,16.51 45.72,19.05 C23.2
  Bottom 0.406: E18.11 24.13,16.51 v43.18,16.51 | C23.2 R1.1
N$25
  Top 0.406: D1.C C23.1
  Bottom 0.406: C23.1 E13.10 | E13.12 43.18,43.18 D1.C R2.2
N$26
  Top 0.406: R3.1 E9.1 | E13.9 39.37,39.37 39.37,46.99 E13.13
  Bottom 0.406: E9.1 13.97,95.25 13.97,49.53 39.37,49.53 E13.13
N$28
  Top 0.406: E17.9 E17.10
  Bottom 0.406: E17.9 E17.6
N$29  (via drill 0.81)
  Top 0.406: E17.2 E17.1 31.75,24.13 31.75,37.47 v28.57,40.64
  Bottom 0.406: E14.12 27.94,40.64 v28.57,40.64
N$30
  Top 0.406: E18.6 16.51,11.43 16.51,23.5 13.97,26.04 13.97,39.37 E14.5
PWR
  Bottom 0.406: E16.11 59.69,16.51 117.47,16.51 U$5.BR2
RD_HOLE_1  (via drill 0.81)
  Top 0.406: v48.9,122.56 E4.12 | v102.23,120.65 v98.42,124.46
  Bottom 0.406: v48.9,122.56 50.8,124.46 v98.42,124.46 | v102.23,120.65 104.14,118.75 117.47,118.75 U$5.AD2
RD_HOLE_2  (via drill 0.81)
  Top 0.406: v110.49,126.36 110.49,119.38 111.12,118.75 117.47,118.75 U$5.AD1
  Bottom 0.406: E4.2 29.21,120.65 15.88,120.65 15.24,121.28 15.24,126.36 v110.49,126.36
RD_HOLE_3  (via drill 0.81)
  Top 0.406: E3.12 55.88,116.84 55.88,122.56 56.52,123.19 84.45,123.19 v84.45,115.57
  Bottom 0.406: v84.45,115.57 117.47,115.57 U$5.AE2
RD_HOLE_4
  Top 0.406: E3.2 54.61,120.65 54.61,122.56 60.96,128.91 109.22,128.91 109.22,117.47 111.12,115.57 117.47,115.57 U$5.AE1
RD_HOLE_5
  Bottom 0.406: E2.12 77.47,113.03 107.31,113.03 111.12,109.22 117.47,109.22 U$5.AH2
RD_HOLE_6  (via drill 0.81)
  Top 0.406: E2.2 74.3,111.12 v74.3,107.31 | v102.23,107.95 110.49,107.95 111.12,108.58 117.47,108.58 U$5.AH1
  Bottom 0.406: v74.3,107.31 74.93,107.95 v102.23,107.95
RD_HOLE_7
  Bottom 0.406: E1.12 109.22,114.3 111.12,112.39 117.47,112.39 U$5.AF2
RD_HOLE_8
  Top 0.406: E1.2 92.71,116.84 92.71,113.67 93.34,113.03 110.49,113.03 111.12,112.39 117.47,112.39 U$5.AF1
RDR_FLAG
  Top 0.406: E9.8 E9.9 21.59,85.09 21.59,87.63 E9.11 19.05,92.71 19.05,105.41 E5.5
RDR_RUN
  Bottom 0.406: E5.9 21.59,107.95 14.61,107.95 12.7,109.86 12.7,116.84 E5.2
RFC_DELAYED
  Top 0.406: E18.13 24.13,21.59 24.13,46.35 23.5,46.99 | 23.5,46.99 15.24,46.99 E14.2 | 26.67,109.22 30.48,109.22 30.48,116.84 E4.1 | 26.67,109.22 E5.10 | 23.5,46.99 26.04,49.53 26.04,97.79 26.67,98.42 26.67,109.22
  Bottom 0.406: E14.2 16.51,46.99 27.3,46.99 32.38,41.91 34.29,41.91 E13.8 | E4.1 38.1,119.38 E4.13 43.18,119.38 E3.1 55.88,119.38 E3.13 60.96,119.38 E2.1 73.66,119.38 E2.13 83.82,116.84 E1.1 88.9,116.84 E1.13
SHIFT
  Top 0.406: E11.11 85.09,34.29 90.17,34.29 90.17,36.83 92.71,39.37 100.97,39.37 100.97,28.57 101.6,27.94 107.95,27.94 107.95,32.38 111.12,35.56 117.47,35.56 U$5.BJ1
  Bottom 0.406: E11.11 73.66,45.72 E11.3
SKIP
  Bottom 0.406: E9.13 30.48,101.6 110.49,101.6 111.12,102.23 117.47,102.23 U$5.AK2
STOP_COMPLETE
  Top 0.406: E16.1 50.8,33.66 52.07,34.92 52.07,44.45 E12.3
  Bottom 0.406: E16.1 52.07,24.13 110.49,24.13 111.12,23.5 117.47,23.5 U$5.BN2
VCC  (via drill 0.81)
  Top 0.406: C16.1 58.42,24.13 E16.14 | C17.1 40.64,24.13 E17.14 | E15.14 74.93,24.13 C15.1 | E11.10 81.28,35.56 R4.2 | E13.14 40.64,52.07 C13.1 39.37,58.42 | 39.37,58.42 C8.1 | 39.37,58.42 38.1,58.42 C19.1 | E10.14 92.71,52.07 C10.1 92.71,57.15 91.44,58.42 | C20.1 55.88,58.42 57.15,57.15 C12.1 58.42,52.07 E12.14 67.31,50.8 | E11.14 E11.13 | 73.66,58.42 74.93,57.15 C11.1 | E11.1 67.31,50.8 | 73.66,58.42 74.93,58.42 | 74.93,58.42 91.44,58.42 | 91.44,58.42 C22.1 | 73.66,58.42 C21.1 | 74.93,58.42 C6.1 | E11.4 67.31,44.45 67.31,50.8 | 21.59,118.11 E5.14 22.86,120.65 C5.1 | 21.59,118.11 E5.4 21.59,105.41 21.59,102.87 R3.2 E9.14 | 21.59,118.11 E5.13 | E14.14 22.86,52.07 C14.1 C9.1 | C4.1 40.64,120.65 E4.14 E4.4 | E8.14 39.37,97.79 39.37,107.95 E4.10 | C3.1 58.42,120.65 E3.14 59.69,118.11 59.69,111.76 | E7.14 59.69,97.79 59.69,107.95 | E3.10 59.69,107.95 | 59.69,107.95 59.69,111.76 | E1.10 87.63,109.22 87.63,110.49 E1.4 77.47,111.76 | E1.14 92.71,120.65 C1.1 v98.42,127.64 | C2.1 76.2,120.65 E2.14 77.47,118.11 77.47,111.76 | E6.14 77.47,97.79 77.47,107.95 | E2.10 77.47,107.95 | 77.47,107.95 77.47,111.76 | E2.4 59.69,111.76
  Bottom 0.406: C18.1 21.59,22.86 E18.14 26.67,26.67 38.1,26.67 C17.1 R1.2 49.53,26.67 55.88,26.67 C16.1 58.42,26.67 80.01,26.67 | E11.10 73.66,43.18 E11.4 | 80.01,26.67 78.74,25.4 C15.1 | 80.01,26.67 R4.2 | C7.1 58.42,77.47 73.66,77.47 C6.1 | E11.14 74.93,50.8 | 74.93,50.8 E11.1 | 74.93,50.8 C11.1 | C19.1 38.1,58.42 55.88,58.42 C20.1 | U$5.BA2 117.47,58.42 91.44,58.42 C22.1 | E9.14 21.59,96.52 C9.1 22.86,77.47 38.1,77.47 C8.1 | E3.10 53.34,109.22 E3.4 43.18,111.76 E4.10 35.56,109.22 E4.4 31.75,113.03 16.51,113.03 E5.4 | E2.4 71.12,109.22 E2.10 | C1.1 91.44,120.65 77.47,120.65 E2.14 | v98.42,127.64 117.47,127.64 U$5.AA2

### Text on the board
Top: VRS | M705 | M705
Bottom: M705 | M705